# Altium schematic sheet ezble-ckt.SchDoc
size A4; SheetNumber: 4; SheetTotal: 5
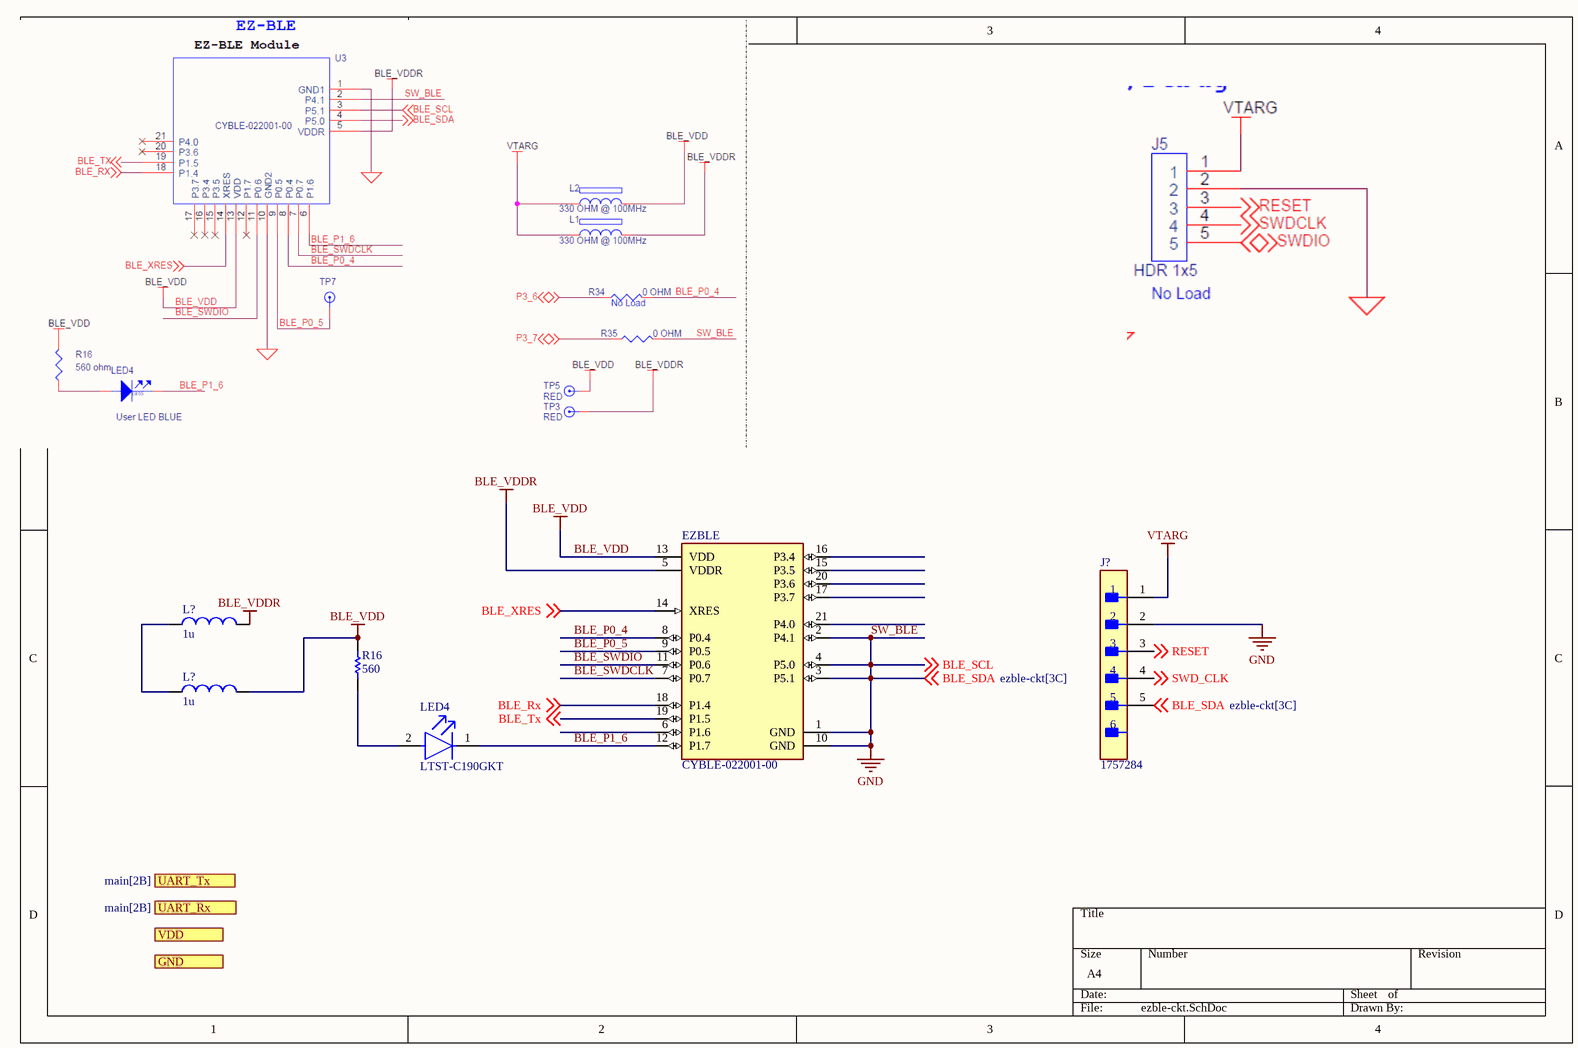
[diagram p0: ezble-ckt.SchDoc]

## Parts
(Parts that share a designator on the sheet are numbered #1, #2 ... from top to bottom, then left to right.)
EZBLE  CYBLE-022001-00  [FP-CYBLE-022001-00-MFG]
J?  1757284  [FP-1757284-MFG]
L?#1  value 1u  (hidden comment: Inductor)
L?#2  value 1u  (hidden comment: Inductor)
LED4  LTST-C190GKT  [FP-LTST-C190GKT-MFG]
R16  R16: 560  (hidden comment: Resistor)

## Ports
GND, UART_Rx (see main[2B]), UART_Tx (see main[2B]), VDD

## Nets
BLE_VDD: EZBLE.13(VDD) L?#2.2 R16.2
BLE_VDDR: EZBLE.5(VDDR) L?#1.2
SW_BLE: EZBLE.1(GND) EZBLE.2(P4.1) EZBLE.3(P5.1) EZBLE.4(P5.0) EZBLE.10(GND) J?.2 J?.5 ; off-sheet BLE_SDA, off-sheet BLE_SCL  [also labelled BLE_SCL, BLE_SDA, GND]
VTARG: J?.1
BLE_P0_4: EZBLE.8(P0.4)
BLE_P0_5: EZBLE.9(P0.5)
BLE_P1_6: EZBLE.12(P1.7) LED4.1(C)
BLE_Rx: EZBLE.18(P1.4) ; off-sheet BLE_Rx
BLE_SWDCLK: EZBLE.7(P0.7)
BLE_SWDIO: EZBLE.11(P0.6)
BLE_Tx: EZBLE.19(P1.5) ; off-sheet BLE_Tx
BLE_XRES: EZBLE.14(XRES) ; off-sheet BLE_XRES
RESET: J?.3 ; off-sheet RESET
SWD_CLK: J?.4 ; off-sheet SWD_CLK
NetL?#1_1: L?#1.1 L?#2.1
NetLED4_2: LED4.2(A) R16.1

Not connected (* = marked no-connect by the designer): EZBLE 6(P1.6) 15(P3.5) 16(P3.4) 17(P3.7) 20(P3.6) 21(P4.0)

## Library data of the parts
EZBLE = CMP-2000-05093-2: RX TXRX MOD BLUETOOTH CHIP SMD; Current - Transmitting: 15.6mA; Current - Receiving: 16.4mA; Interface: I2C; Frequency: 2.4GHz; Sensitivity: -91dBm; Max Supply Voltage: 5.5V; Memory Size: 16KB; Min Supply Voltage: 1.8V; Data Rate: 1Mbps; Min Operating Temperature: -40°C; Mount: Surface Mount; Max Operating Temperature: 85°C; Packaging: Tape and Reel; REACH SVHC: No SVHC; Case/Package: Module; Lead Free: Lead Free; Number of Pins: 21
J? = CMP-09399-000007-1: TERM BLOCK HDR 6POS 90DEG 5.08MM; Gender: Male; Voltage Rating: 250V; Max Current Rating: 12A; Number of Positions: 6; Current: 15A; Approvals: UL; Number of Levels: 1; Voltage: 300V; Voltage Rating (DC): 320V; Connector Type: Plug; Termination: Solder; Weight: 5.396916oz; Flammability Rating: UL94 V-0; Packaging: Bulk; Package Quantity: 50; Contact Plating: Tin; REACH SVHC: No SVHC; Color: Grey; Current Rating: 12A; Mount: Through Hole; Height: 12.1mm; Number of Rows: 1; Number of Contacts: 6; Housing Material: Polybutylene; Series: MSTBA; Pitch: 5.08mm; RoHS Compliant: Yes; Orientation: Right Angle; Housing Color: Green; Length: 32.48mm; Number of Positions Per Level: 6; Width: 32.4mm; Depth: 12mm; Lead Free: Lead Free; Contact Material: Tin; Number of Poles: 6
L?#1 L?#2 = Inductor: SimulationGenericComponent: True
LED4 = CMP-22017-000005-2: LED GREEN CLEAR CHIP SMD; Dominant Wavelength: 569nm; Reverse Voltage: 5V; Lens Color: Colorless; Viewing Angle: 130°; Voltage: 2V; Forward Current: 30mA; Power Dissipation: 100mW; Luminous Intensity: 6mcd; Number of LEDs: 1; Forward Voltage: 2.1V; Wavelength: 565nm; Test Current: 10mA; Min Operating Temperature: -55°C; Lens Style: Clear; Mount: Surface Mount; Width: 0.8mm; Packaging: Tape and Reel; Lens Transparency: Clear; Case Code (Metric): 1608; Depth: 0.8mm; Case Code (Imperial): 0603; Case/Package: 0603; Number of Pins: 2; Max Operating Temperature: 85°C; Lead Free: Lead Free; Number of Elements: 1; Length: 1.6mm; Height: 0.8mm; Package Quantity: 1; Power Rating: 100mW; Radiation Hardening: No; Illumination Color: Green; Color: Green
R16 = Resistor: TC1: 0; SimulationGenericComponent: True; TC2: 0